# Altium schematic sheet 2_RX_Control.schdoc
size 497 x 243 mm
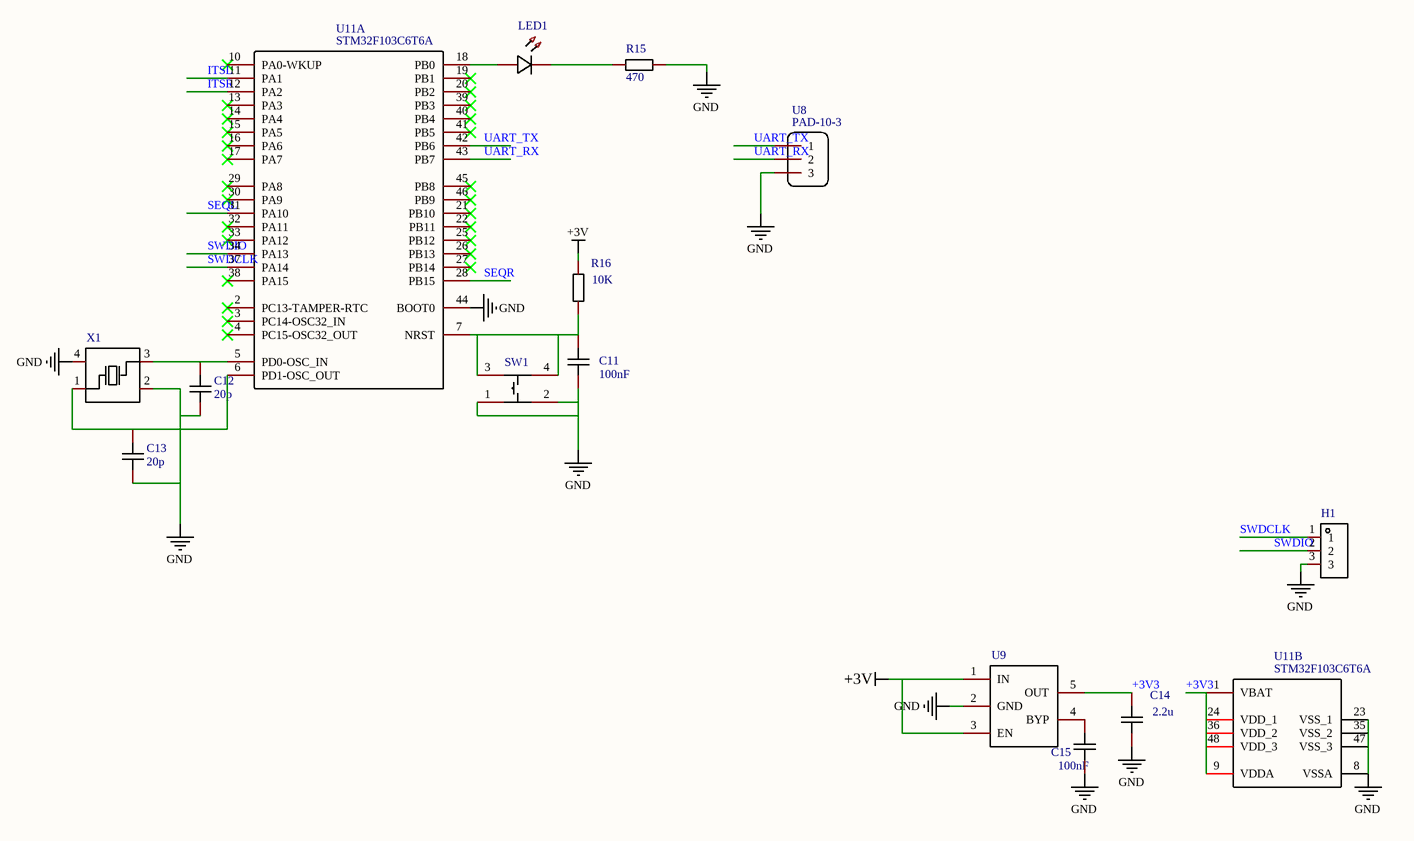
[diagram p0: 2_RX_Control.schdoc]

## Parts
C11  value 100nF  [C0603]  (hidden comment: CAP_0603)
C12  Name: 20p  [C0603]  (hidden comment: CAP_0603)
C13  Name: 20p  [C0603]  (hidden comment: CAP_0603)
C14  value 2.2u  [C0603]  (hidden comment: CAP_0603)
C15  value 100nF  [C0603]  (hidden comment: CAP_0603)
H1  2.54-1*3P正弯针  [HDR-TH_3P-P2.54-H-M-BW7.2-P]  (value not drawn)
LED1  LED_0603-G  [LED0603-RD]  (value not drawn)
R15  value 470  [R0603]  (hidden comment: Res_0603)
R16  value 10K  [R0603]  (hidden comment: Res_0603)
SW1  K2-1809SN-A4DW-06  [KEY-SMD_4P-L3.5-W3.0-P1.50-LS4.6]  (value not drawn)
U8  PAD-10-3  [PAD-10-3]
U9  MIC5205-3.3YM5-TR  [SOT-23-5_L3.0-W1.7-P0.95-LS2.8-TL]  (value not drawn)
U11  STM32F103C6T6A  [LQFP-48_L7.0-W7.0-P0.50-LS9.0-BL]  (parts A,B of 2)
X1  TAXM8M4QLDCDT2T  [OSC-SMD_4P-L5.0-W3.2-BL]  (value not drawn)

## Nets
+3V: R16.2 U9.1(IN) U9.3(EN)
GND: C11.1 C12.1 C13.1 C14.1 C15.1 H1.3 R15.2 SW1.1 SW1.2 U8.3 U9.2(GND) U11.8(VSSA) U11.23(VSS_1) U11.35(VSS_2) U11.44(BOOT0) U11.47(VSS_3) X1.2(GND) X1.4(GND)
+3V3: C14.2 U9.5(OUT) U11.1(VBAT) U11.9(VDDA) U11.24(VDD_1) U11.36(VDD_2) U11.48(VDD_3)
ITSL: U11.11(PA1)
ITSR: U11.12(PA2)
SEQL: U11.31(PA10)
SEQR: U11.28(PB15)
SWDCLK: H1.1 U11.37(PA14)
SWDIO: H1.2 U11.34(PA13)
UART_RX: U8.2 U11.43(PB7)
UART_TX: U8.1 U11.42(PB6)
NetC11_2: C11.2 R16.1 SW1.3 SW1.4 U11.7(NRST)
NetC12_2: C12.2 U11.5(PD0-OSC_IN) X1.3(OSC2)
NetC13_2: C13.2 U11.6(PD1-OSC_OUT) X1.1(OSC1)
NetC15_2: C15.2 U9.4(BYP)
NetLED1_1: LED1.1(C) R15.1
NetLED1_2: LED1.2(A) U11.18(PB0)

Not connected (* = marked no-connect by the designer): U11 2(PC13-TAMPER-RTC)* 3(PC14-OSC32_IN)* 4(PC15-OSC32_OUT)* 10(PA0-WKUP)* 13(PA3)* 14(PA4)* 15(PA5)* 16(PA6)* 17(PA7)* 19(PB1)* 20(PB2)* 21(PB10)* 22(PB11)* 25(PB12)* 26(PB13)* 27(PB14)* 29(PA8)* 30(PA9)* 32(PA11)* 33(PA12)* 38(PA15)* 39(PB3)* 40(PB4)* 41(PB5)* 45(PB8)* 46(PB9)*

## Library data of the parts
C11 C14 C15 = CAP_0603: 容值:100nF;精度:±10%;额定电压:50V;温度系数:X7R;; Symbol: C1210X7R475K630NT; Convert to PCB: yes; Device: CAP_0603; Add into BOM: yes; Supplier Footprint: 0603
C12 C13 = CAP_0603: 容值:100nF;精度:±10%;额定电压:50V;温度系数:X7R;; Symbol: C1210X7R475K630NT; Convert to PCB: yes; Value: 100nF; Device: CAP_0603; Add into BOM: yes; Supplier Footprint: 0603
H1 = 2.54-1*3P正弯针: 间距:2.54mm;总PIN位数:3;排数:1;插针结构:1x3P;行距:-;安装类型:弯插;圆针/方针:方针;额定电流:3A;额定电压:-;配合针长度:3mm;塑高:2.54mm;端接针长度:-;触头材质:-;触头镀层:-;工作温度范围:-55~+105;颜色:黑色;; Manufacturer: BOOMELE(博穆精密); Symbol: C92159; Add into BOM: yes; Pitch: 2.54mm; Pin Structure: 1x3P; Circluar Pins/Square Pins: 方针; Current Rating (Max): 3A; Device: 2.54-1*3P正弯针; LCSC Part Name: 2.54mm 1x3P; Supplier Part: C92159; Manufacturer Part: 2.54-1*3P正弯针; Supplier Footprint: 插件,P=2.54mm; JLCPCB Part Class: Extended Part; Datasheet: https://atta.szlcsc.com/upload/public/pdf/source/20181121/C2334_B051029C4931EB562F9DCCAAD18AC88A.pdf; Supplier: LCSC; Convert to PCB: yes; Number of Pins: 3; Number of Rows: 1; Row Spacing: -; Mounting Type: 弯插; Voltage Rating (Max): -; Length of Mating Pin: 3mm; Insulation Height: 2.54mm; Length of End Connection Pin: -; Contact Material: -; Contact Plating: -; Operating Temperature Range: -55~+105; Color: 黑色
LED1 = LED_0603-G: 照明颜色:翠绿;色温 - CCT（K）:-;主波长/色坐标:520~535nm;; Symbol: LED_G; Convert to PCB: yes; Device: LED_0603-G; Add into BOM: yes; Supplier Footprint: 0603; Supplier Part: C72043
R15 R16 = Res_0603: Symbol: 电阻; Convert to PCB: yes; Device: Res_0603; Add into BOM: yes; Supplier Footprint: 0603
SW1 = K2-1809SN-A4DW-06: 触点电流:50mA;额定电压(DC):12V;绝缘电阻:100MΩ;电路结构:单刀单掷;安装方式:立贴;按钮形状:圆形按钮;带灯:-;作用力:250gf@±30gf;机械寿命:100000;工作温度:-25~+85;开关长度:3.5mm;开关宽度:3mm;开关高度:1.8mm;; Manufacturer: 韩国韩荣; Add into BOM: yes; Contact Current: 50mA; Voltage Rating (DC): 12V; Insulation Resistance: 100MΩ; Circuit: 单刀单掷; Actuator Style: 圆形按钮; Mechanical Life: 100000; Switch Length: 3.5mm; Switch Width: 3mm; Switch Height: 1.8mm; Symbol: K2-1809SN-A4DW-06; Device: K2-1809SN-A4DW-06; LCSC Part Name: K2-1809SN-A4DW-06; Supplier Part: C223823; Manufacturer Part: K2-1809SN-A4DW-06; Supplier Footprint: SMD; JLCPCB Part Class: Extended Part; Datasheet: https://atta.szlcsc.com/upload/public/pdf/source/20180622/C223823_5E61BEAD00667DA976D15EE542974EF8.pdf; Supplier: LCSC; Convert to PCB: yes; Mounting Style: 立贴; With Lamp: -; Operating Force: 250gf@±30gf; Operating Temperature: -25~+85
U8 = PAD-10-3: Convert to PCB: yes; NUMBER: 3; Name: PAD-10-3; Symbol: PAD-10-3; Device: PAD-10-3; Add into BOM: yes; Origin Footprint: PAD-10-3
U9 = MIC5205-3.3YM5-TR: 输出类型:固定;输出极性:正;输出通道数:1;最大输入电压:16V;输出电压:3.3V;压差:350mV@(150mA);输出电流:150mA;电源纹波抑制比(PRSS):75dB@(100Hz);; Manufacturer: MICROCHIP(美国微芯); Add into BOM: yes; Output Type: 固定; Output Polarity: 正; Number of Outputs: 1; Maximum Input Voltage: 16V; Output Voltage: 3.3V; Symbol: MIC5205-3.3YM5; Device: MIC5205-3.3YM5-TR; LCSC Part Name: Vin=16V Vout=3.3V 150mA 75dB@(100Hz); Supplier Part: C37970; Manufacturer Part: MIC5205-3.3YM5-TR; Supplier Footprint: SOT-23-5; JLCPCB Part Class: Extended Part; Datasheet: https://atta.szlcsc.com/upload/public/pdf/source/20210624/C37970_695848EAF266CFCDDC55149329A6B695.pdf; Supplier: LCSC; Convert to PCB: yes; Dropout Voltage: 350mV@(150mA); Output Current: 150mA; Power Supply Rejection Ratio (PRSS): 75dB@(100Hz)
U11 = STM32F103C6T6A: Manufacturer: ST; tags: STM32; Convert to PCB: yes; Name: STM32F103C6T6A; Symbol: STM32F103C6T6A; Device: STM32F103C6T6A; Supplier Part: C8303; Supplier: LCSC; Manufacturer Part: STM32F103C6T6A; JLCPCB Part Class: Extended Part; Add into BOM: yes; Origin Footprint: LQFP-48_L7.0-W7.0-P0.50-LS9.0-BL
X1 = TAXM8M4QLDCDT2T: 晶振类型:-;频率:-;频率公差:-;频率稳定度:-;负载电容:-;工作温度:-;; Manufacturer: TAE(雅晶鑫); Symbol: SMD-5032_4P8M20PF20PPM; Add into BOM: yes; Device: TAXM8M4QLDCDT2T; LCSC Part Name: SMD-5032_4P 8M 20pf 20ppm; Supplier Part: C133333; Manufacturer Part: TAXM8M4QLDCDT2T; Supplier Footprint: SMD5032-4P; JLCPCB Part Class: Extended Part; Datasheet: https://atta.szlcsc.com/upload/public/pdf/source/20171014/C133333_15079754961691038230.pdf; Supplier: LCSC; Convert to PCB: yes; Crystal Type: -; Value: -; Frequency Tolerance: -; Frequency Stability: -; Load Capacitance: -; Operating Temperature: -